# Altium schematic sheet power.SchDoc
size 297 x 209 mm; Address1: Address1; Address2: Address2; Address3: Address3; Address4: Address4; SheetNumber: 1; Scale: 1:1; Обозначение документа: АБВГ.123456.001Э3
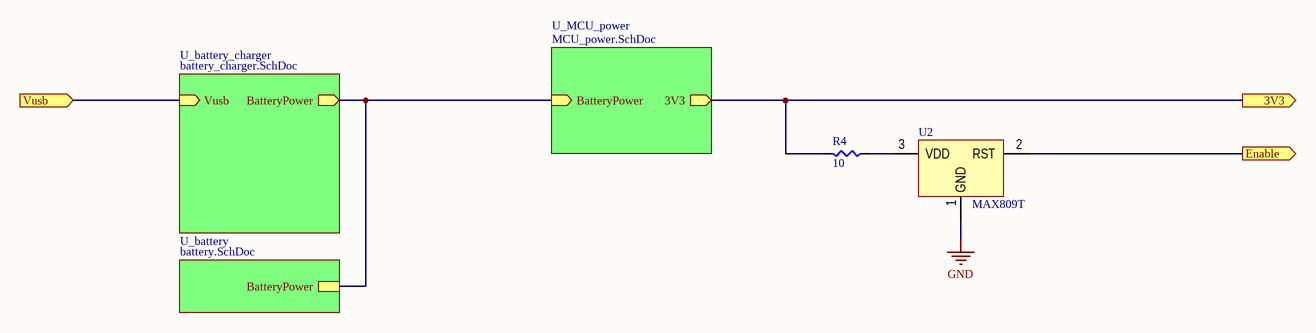
[diagram p0: power.SchDoc]

## Parts
R4  10  [RES0603]
U2  MAX809T  [SOT-23-3]

## Sub-sheets
U_battery = battery.SchDoc: BatteryPower
U_battery_charger = battery_charger.SchDoc: BatteryPower (out), Vusb (in)
U_MCU_power = MCU_power.SchDoc: BatteryPower (in), 3V3 (out)

## Ports
3V3 (out), Enable (out), Vusb (in)

## Nets
GND: U2.1(GND)
3V3: R4.1 ; port 3V3, sheet U_MCU_power/3V3
Enable: U2.2(RST) ; port Enable
Vusb: port Vusb, sheet U_battery_charger/Vusb
NetR4_2: R4.2 U2.3(VDD)
(unnamed): sheet U_battery/BatteryPower, sheet U_battery_charger/BatteryPower, sheet U_MCU_power/BatteryPower

## Notes on the sheet
- Подп. и дата
- Инв. № дубл.
- Взам. инв. №
- Инв. № подл.
- Изм.
- Лист
- № докум.
- Подп.
- Дата
- Копировал
- Формат А4

## Library data of the parts
R4 = RC0603FR-0710RL: Tolerance ±1% / Power (Watts) 0.1W, 1/10W / Temperature Coefficient ±100ppm/°C; Manufacturer: YAGEO; Item: 10 ±1% 0.1W; Part Number: RC0603FR-0710RL; Supplier 1: Mouser; Supplier Part Number 1: 603-RC0603FR-0710RL; Case: 0603; Tolerance: 1%; Value: 10; HelpURL: https://www.mouser.com/datasheet/2/447/PYu_RC_Group_51_RoHS_L_11-1984063.pdf; Category: Thin Film Resistors - SMD
U2 = MAX809T: Power monitor 3.08В SOT23-3; Manufacturer: UMW; Part Number: MAX809T; Item: MAX809T; Supplier 1: ChipDip; Supplier Part Number 1: 9001067621; Case: SOT-23; HelpURL: https://static.chipdip.ru/lib/848/DOC018848681.pdf; Category: Supervisory Circuits